# EAGLE design  ADS-B LNA Bias-T (EAGLE 9.5.1)
CNAME: ADS-B LNA Filter; CREVISION: 1.0; DESIGNER: Ujjwal John, VU3ECN
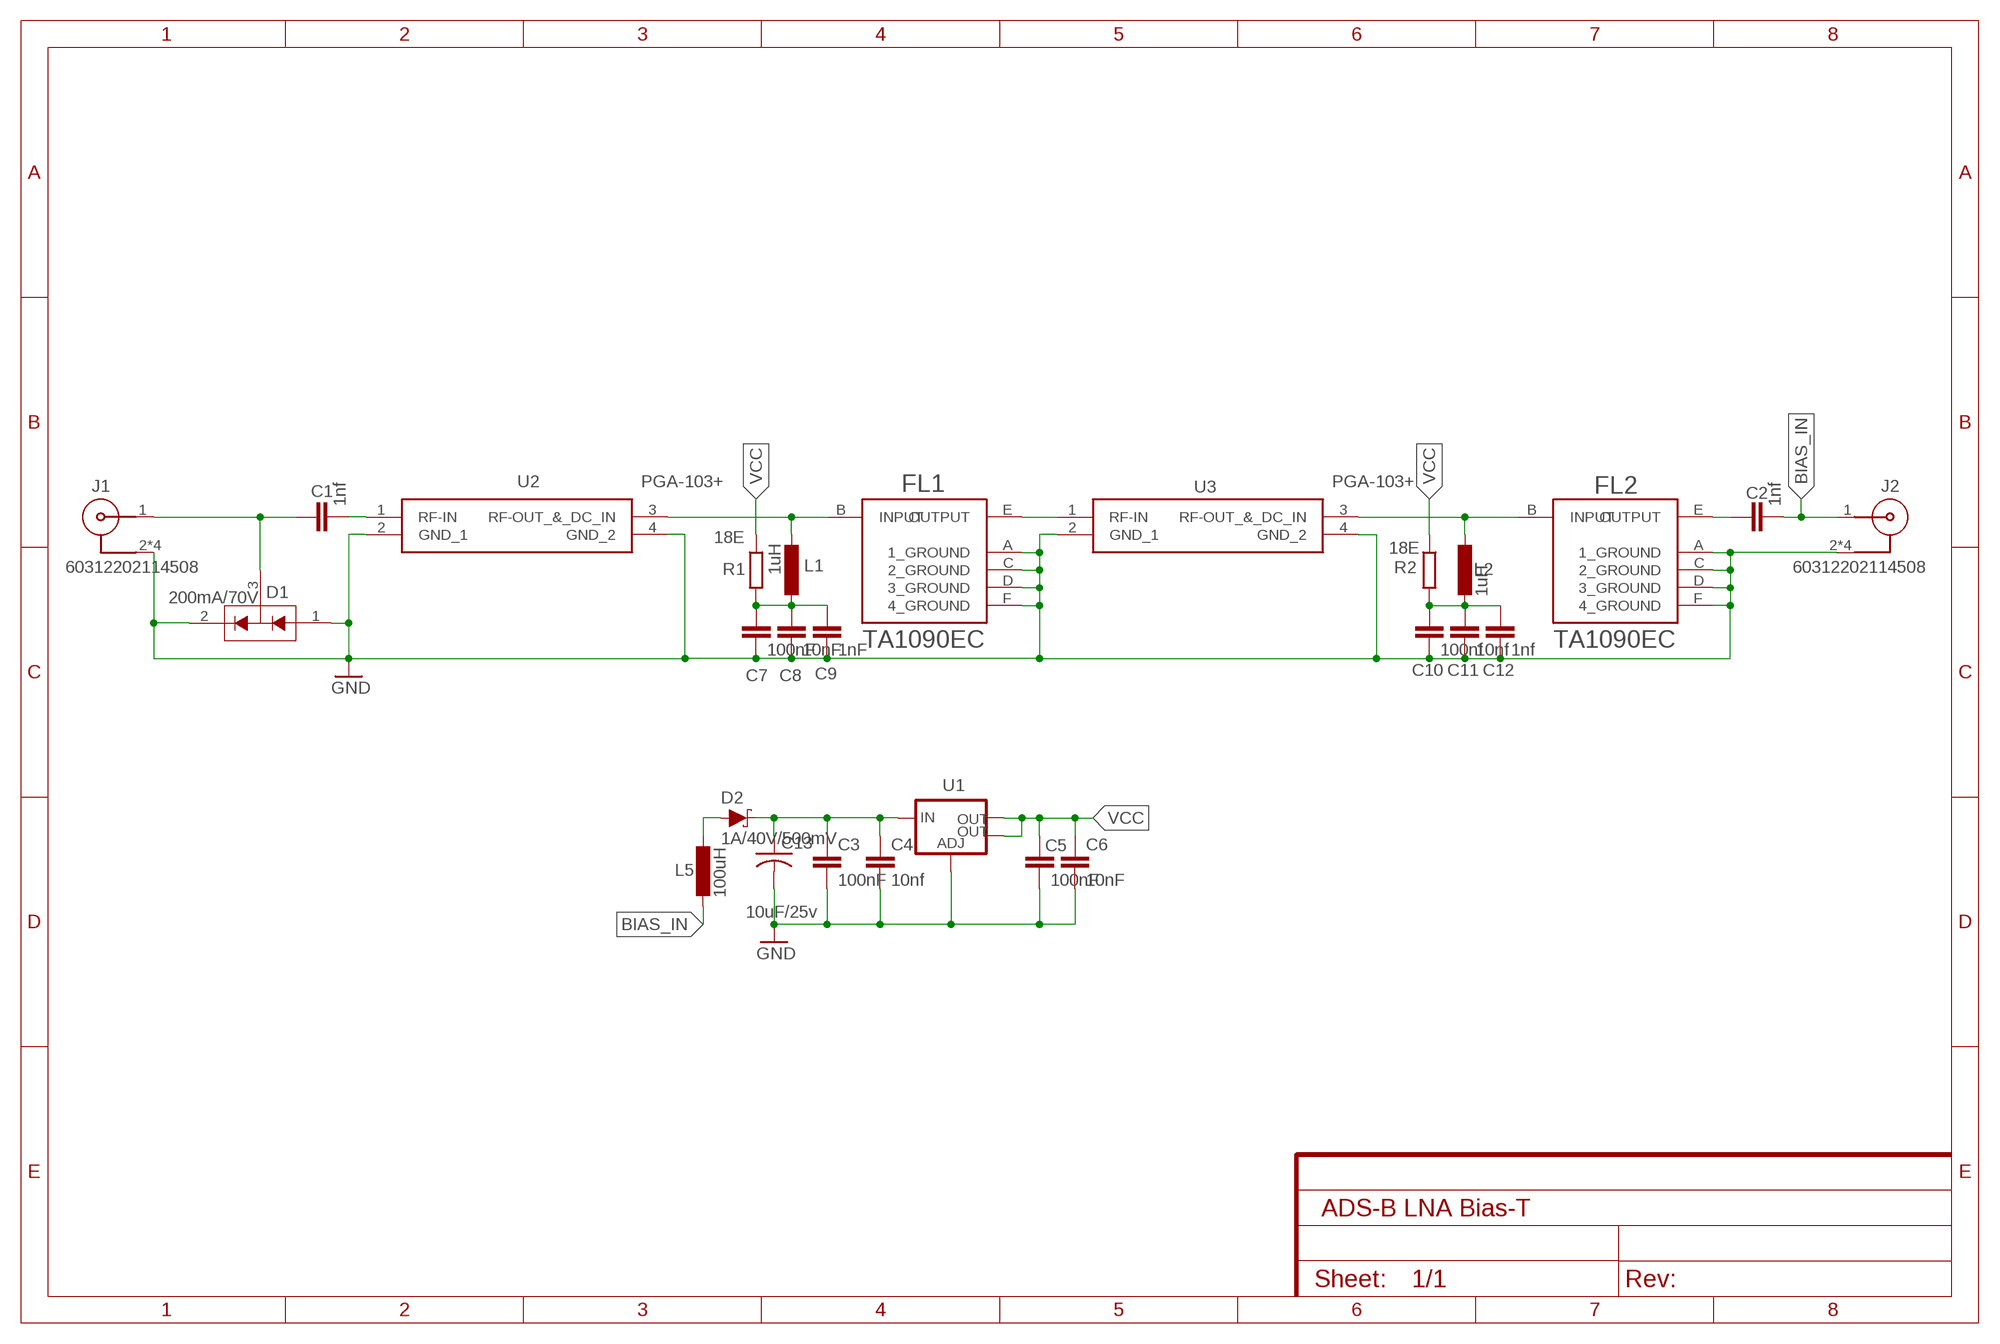
[diagram p0: schematic, sheet 1]

## Parts
C1  1nf  C-EUC0603K  [C0603K]
C2  1nf  C-EUC0603K  [C0603K]
C3  100nF  C-EUC0603K  [C0603K]
C4  10nf  C-EUC0603K  [C0603K]
C5  100nF  C-EUC0603K  [C0603K]
C6  10nF  C-EUC0603K  [C0603K]
C7  100nF  C-EUC0603K  [C0603K]
C8  10nF  C-EUC0603K  [C0603K]
C9  1nF  C-EUC0603K  [C0603K]
C10  100nf  C-EUC0603K  [C0603K]
C11  10nf  C-EUC0603K  [C0603K]
C12  1nf  C-EUC0603K  [C0603K]
C13  10uF/25v  C-USC3216  [C3216]
D1  200mA/70V  BAV99  [SOT23-3]
D2  1A/40V/500mV  DIODE-SCHOTTKY-SS14  [SMA-DIODE]
FL1  TAI-SAW_TECHNOLOGY_TA1090ECTAI-SAW_TECHNOLOGY_TA1090EC_0_0  [TAI-SAW_TECHNOLOGY_TA1090EC_0]
FL2  TAI-SAW_TECHNOLOGY_TA1090ECTAI-SAW_TECHNOLOGY_TA1090EC_0_0  [TAI-SAW_TECHNOLOGY_TA1090EC_0]
J1  60312202114508  [60312202114508]
J2  60312202114508  [60312202114508]
L1  1uH  L-EUL3230M  [L3230M]
L2  1uH  L-EUL3225M  [L3225M]
L5  100uH  L-EUL4532C  [L4532M]
R1  18E  R-EU_R1206  [R1206]
R2  18E  R-EU_R1206  [R1206]
U1  V_REG_LM1117SOT223  [SOT223]
U2  PGA-103+  [GVA63]
U3  PGA-103+  [GVA63]

## Nets
BIAS_IN: C2.2 J2.1 L5.2
GND: C3.2 C4.2 C5.2 C6.2 C7.2 C8.2 C9.2 C10.2 C11.2 C12.2 C13.2 D1.1(A1) D1.2(C2) FL1.A(1_GROUND) FL1.C(2_GROUND) FL1.D(3_GROUND) FL1.F(4_GROUND) FL2.A(1_GROUND) FL2.C(2_GROUND) FL2.D(3_GROUND) FL2.F(4_GROUND) J1.2 J1.3 J1.4 J1.5 J2.2 J2.3 J2.4 J2.5 U1.1(ADJ) U2.2(GND_1) U2.4(GND_2) U3.2(GND_1) U3.4(GND_2)
N$1: C1.2 U2.1(RF-IN)
N$2: C1.1 D1.3(COM) J1.1
N$3: FL1.E(OUTPUT) U3.1(RF-IN)
N$4: C7.1 C8.1 C9.1 L1.1 R1.2
N$5: C2.1 FL2.E(OUTPUT)
N$6: FL1.B(INPUT) L1.2 U2.3(RF-OUT_&_DC_IN)
N$7: C3.1 C4.1 C13.1 D2.C U1.3(IN)
N$8: C10.1 C11.1 C12.1 L2.2 R2.2
N$9: D2.A L5.1
N$10: FL2.B(INPUT) L2.1 U3.3(RF-OUT_&_DC_IN)
VCC: C5.1 C6.1 R1.1 R2.1 U1.2(OUT) U1.4(OUT)

## Library data of the parts
C1-C12 = rcl:C-EU: CAPACITOR, European symbol; SPICEPREFIX: C
C13 = rcl:C-US: CAPACITOR, American symbol; SPICEPREFIX: C
D1 = SparkFun-DiscreteSemi:BAV99: Series-pair diode array Two small signal silicon diodes connected anode to cathode. Connections to all three nodes available. Link to datasheet <https://www.fairchildsemi.com/datasheets/BA/BAV99.pdf> SparkFun Products: SparkFun AutoDriver <https://www.sparkfun.com/products/13752>; PROD_ID: DIO-10647
D2 = SparkFun-DiscreteSemi:DIODE-SCHOTTKY: Schottky diode A Schottky diode is a semiconductor diode which has a low forward voltage drop and a very fast switching action.; PROD_ID: DIO-08053
FL1 FL2 = Tai-Saw Technology - TA1090EC:TAI-SAW_TECHNOLOGY_TA1090EC: SAW Filter 1090MHz; BANDWIDTH: 30Mhz; CENTROID_NOT_SPECIFIED: No; DATASHEET: http://datasheet.octopart.com/TA1090EC-Tai-Saw-Technology-datasheet-15990272.pdf; FREQUENCY: 1090Mhz; IMPORTED_FROM: octopart; MF: Tai-Saw Technology; MPN: TA1090EC; NUM_PINS: 6; OCTOPART_PART_NUMBER: 42898a0e4c549d4e; PACKAGE: SMD_TA1090EC; PREFIX: FL; TEMPERATURE_RANGE_HIGH: +85°C; TEMPERATURE_RANGE_LOW: -30°C; TYPE: Filter, SAW, 1090 MHz, 30 MHz BW
J1 J2 = SMA Female PCB Edge S:60312202114508: WR-SMA PCB End Launch Jack Round Post 1.1 mm MATERIAL PROPERTIES Insulator Material PTFE Insulator Color White Center Contact Material Beryllium Copper Center Contact Plating Gold, min. 0.76µm over Nickel Body Material Brass Body Plating Gold, min. 0.076µm over Nickel KIND PROPERTIES Interface MIL-STD-348 Connector Type SMA Gender Jack Orientation Type Straight GENERAL INFORMATION: Operating Temperature -65 °C up to +165 °C Compliance RoHS ELECTRICAL PROPERTIES Frequency Range DC~18 GHz MECHANICAL PROPERTIES Mating Cycle 500 Cycles PACKAGING PROPERTIES Packaging Tray <https://katalog.we-online.com/media/images/v2/o122847v209%20WR-SMA_60312202114508.jpg> Details see: https://katalog.we-online.com/en/em/WR-SMA_60312202114508 Updated by Ella Wu, 2019-11-07 2019(C) Würth Elektronik Buy Part <https://snapeda.com/parts/60312202114508/W%C3%BCrth%20Elektronik/view-part/?ref=eda>; AVAILABILITY: Warning; DESCRIPTION: SMA Connector Jack, Female Socket 50Ohm Board Edge, End Launch Solder; DIGIKEY-PURCHASE-URL: https://snapeda.com/shop?store=DigiKey&id=4477264; MF: Würth Elektronik; MOUSER-PURCHASE-URL: https://snapeda.com/shop?store=Mouser&id=4477264; MP: 60312202114508; PACKAGE: None; PRICE: None
L1 = resistor:L-EU: INDUCTOR, European symbol
L2 L5 = rcl:L-EU: INDUCTOR, European symbol; SPICEPREFIX: L
R1 R2 = resistor:R-EU_: RESISTOR, European symbol
U1 = SparkFun-IC-Power:V_REG_LM1117: Voltage Regulator LM1117 Standard adjustable voltage regulator but in SMD form. Spark Fun Electronics SKU : COM-00595; PROD_ID: VREG-08170
U2 U3 = PGA-103+:PGA-103+: RF Amplifier SMT Low Noise Amplifier, 50Ohm - 4000 MHz, 50 Source: Datasheet <https://www.minicircuits.com/pdfs/PGA-103 .pdf>; DESCRIPTION: RF Amplifier SMT Low Noise Amplifier, 50Ohm - 4000 MHz, 50; HEIGHT: 1mm; MANUFACTURER_NAME: Mini-Circuits; MANUFACTURER_PART_NUMBER: PGA-103+; MOUSER_PART_NUMBER: 139-PGA-103; MOUSER_PRICE-STOCK: https://www.mouser.co.uk/ProductDetail/Mini-Circuits/PGA-103%2b?qs=xZ%2FP%252Ba9zWqZWniifnGTm5A%3D%3D

## Board
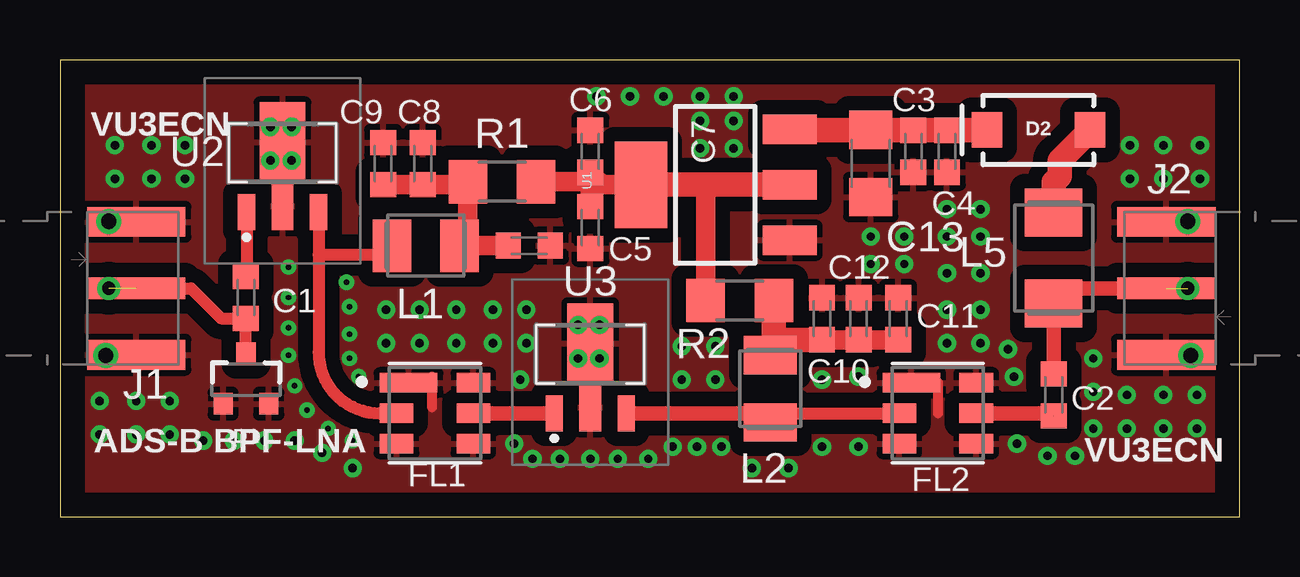
[diagram p1: board, top side]
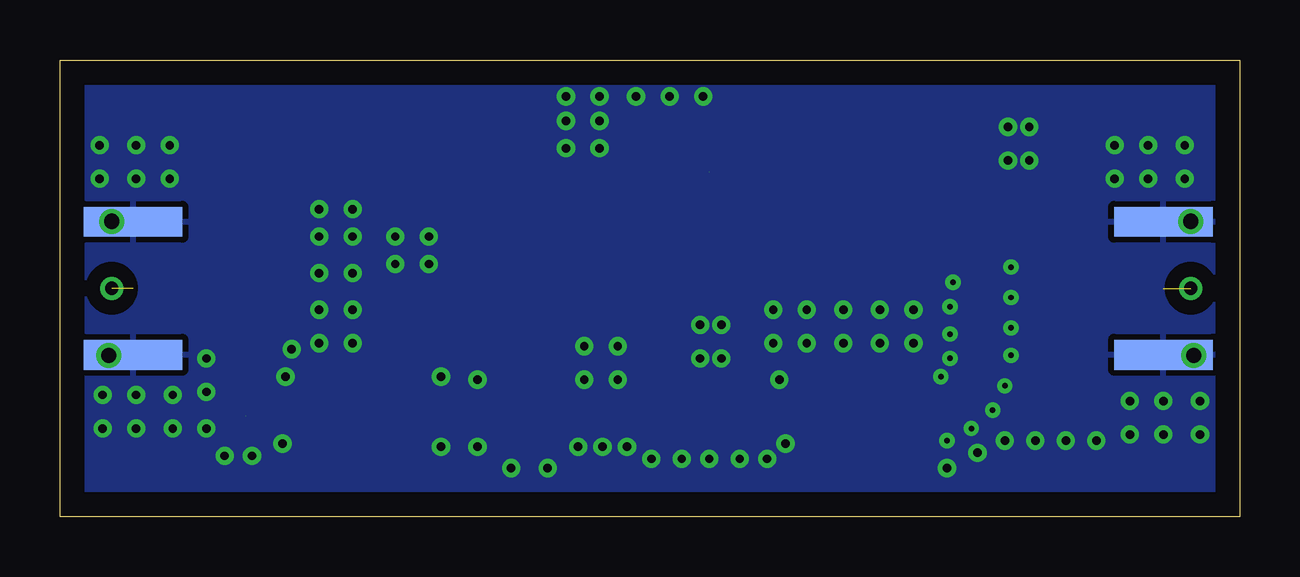
[diagram p2: board, bottom side, seen from below]

Size 49.15 x 19.05 mm. Coordinates in mm from the lower left corner, seen from the top.
Outline: 0,0 49.15,0 49.15,19.05 0,19.05 0,0
Copper layers (1*16): Top 0.035mm / dielectric 1.5mm / Bottom 0.035mm
Design rules "default *": minimum track width 6mil, minimum drill 0.35mm, track to track 24mil, track to pad 24mil, pad to pad 24mil, via to via 24mil, smd to smd 24mil, copper to edge 40mil, drill to drill 6mil, minimum pad ring 10mil, minimum via ring 8mil, stop-mask expansion 4mil, vias tented up to drill 0mil, thermal gap 10mil

### Footprints (pad centres in the part's own frame; a part is rotated, then mirrored left to right if it is on the bottom)
C0603K = smd 1.05 x 1.08: 1 -0.875,0; 2 0.875,0
C3216 = smd 1.6 x 1.8: 1 -1.4,0; 2 1.4,0
SOT23-3 = smd 0.8 x 0.9: 1 -0.95,-1; 2 0.95,-1; 3 0,1.1
SMA-DIODE = smd 1.27 x 1.47: A -2.15,0; C 2.15,0
TAI-SAW_TECHNOLOGY_TA1090EC_0 = smd 2.4 x 0.8: A -1.1,1.27 | smd 1.4 x 0.8: B -1.6,0; C -1.6,-1.27; D 1.6,-1.27; E 1.6,0; F 1.6,1.27
60312202114508 = smd 0.9 x 4.1: 1 0,0 | smd 1.25 x 4.1: 2 -2.775,0; 3 2.775,0 | smd 1.25 x 4.1 bottom: 4 -2.775,0; 5 2.775,0
L3230M = smd 1.6 x 2.2: 1 -1.4,0; 2 1.4,0
L3225M = smd 1.6 x 2.2: 1 -1.4,0; 2 1.4,0
L4532M = smd 2 x 2.4: 1 -1.9,0; 2 1.9,0
R1206 = smd 1.6 x 1.803: 1 -1.422,0; 2 1.422,0
SOT223 = smd 1.219 x 2.235: 1 -2.311,-3.099; 2 0,-3.099; 3 2.311,-3.099 | smd 3.6 x 2.2: 4 0,3.099
GVA63 = smd 0.711 x 1.5: 1 -1.5,-1.27; 3 1.5,-1.27 | smd 0.914 x 2: 2 0,-1.02 | smd 1.905 x 3.334: 4 0,1.647

### Placement (x,y rotation side)
C1  7.75,9.14 90 top
C2  41.4,5.08 90 top
C3  35.56,15.24 270 top
C4  36.96,15.24 270 top
C5  22.1,12.06 270 top
C6  22.1,15.24 90 top
C7  19.56,11.3 0 top
C8  15.11,14.73 90 top
C9  13.46,14.73 90 top
C10  31.75,8.26 90 top
C11  34.92,8.26 90 top
C12  33.27,8.26 90 top
C13  33.78,14.73 270 top
D1  7.75,5.71 0 top
D2  40.77,16.13 180 top
FL1  15.62,4.32 0 top
FL2  36.58,4.32 0 top
J1  3.18,9.53 270 top
J2  46.1,9.53 90 top
L1  15.24,11.3 180 top
L2  29.59,5.33 90 top
L5  41.4,10.79 270 top
R1  18.41,13.97 180 top
R2  28.32,9.02 0 top
U1  27.31,13.84 90 top
U2  9.27,13.97 0 top
U3  22.1,5.59 0 top

### Tracks (layer width: path | path; a pad name or v marks a point on that pad's centre or on a via)
BIAS_IN  (via drill 0.55)  (1 unrouted)
  Top 0.61: C2.2 L5.2 42.03,9.53 J2.1
  other vias: 46.99,9.53
GND  (via drill 0.23, 0.35, 0.64)
  Top 0.305: U3.4 U3.2
  Top 0.406: 15.49,5.84 15.49,4.57 | 36.58,5.59 36.58,4.32
  other vias: 13.59,8.64 14.99,8.64 14.99,7.24 13.59,7.24 19.18,5.71 31.75,5.71 18.92,3.05 25.53,2.92 26.54,2.92 27.56,2.92 28.83,2.03 33.27,5.84 39.88,3.05 39.75,5.84 2.29,15.49 3.81,15.49 5.21,15.49 5.21,14.1 3.81,14.1 2.29,14.1 47.5,14.1 45.97,14.1 44.58,14.1 44.58,15.49 45.97,15.49 47.5,15.49 44.45,5.08 45.97,5.08 47.37,5.08 47.37,3.68 45.97,3.68 44.45,3.68 22.35,17.53 23.75,17.53 28.07,16.51 26.67,16.51 28.07,17.53 26.67,17.53 25.15,17.53 27.31,5.71 25.91,5.71 25.91,7.11 27.31,7.11 16.51,8.64 18.03,8.64 19.43,8.64 19.43,7.24 18.03,7.24 16.51,7.24 41.15,2.54 42.29,2.54 30.35,2.03 31.75,2.92 33.27,2.92 43.05,3.68 43.05,5.21 43.05,6.6 19.69,2.41 20.83,2.41 24.51,2.41 23.24,2.41 22.1,2.41 36.96,7.24 36.96,8.64 38.35,8.64 38.35,7.24 36.96,10.16 36.96,11.68 36.96,12.83 38.35,12.83 38.35,11.68 38.35,10.16 28.07,15.37 26.67,15.37 35.18,11.68 33.78,11.68 35.18,10.54 33.78,10.54 1.65,4.83 3.18,4.83 4.57,4.83 4.57,3.43 3.18,3.43 1.65,3.43 2.03,12.32 1.91,6.73 46.99,12.32 47.12,6.73 8.76,16.26 8.76,14.86 9.65,16.26 9.65,14.86 21.59,8 21.59,6.6 22.48,8 22.48,6.6 39.5,6.99 5.97,3.18 9.53,10.41 9.53,9.14 9.53,7.87 9.53,6.73 9.78,5.46 10.29,4.45 11.18,3.68 12.19,3.18 11.94,9.78 12.07,8.76 12.07,7.62 12.07,6.6 12.45,5.84 7.24,3.18 9.78,3.18 10.92,2.67 8.51,3.18 12.19,2.03
  pour Top: -3.56,21.08 -3.56,-1.78 52.32,-1.78 52.32,21.08
  pour Bottom: -5.71,24.26 -5.71,-2.41 52.7,-2.41 52.7,24.26
N$1
  Top 0.508: U2.1 7.77,10.04 arc-90 C1.2
N$2  (via drill 0.55)  (1 unrouted)
  Top 0.508: D1.3 C1.1 6.72,8.27 5.46,9.53 J1.1
  other vias: 2.03,9.53
N$3
  Top 0.61: U3.1 FL1.E
N$4
  Top 0.813: C9.1 C8.1 16.88,13.86 R1.2 16.99,11.66 L1.1 C7.1
  Top 1.016: L1.1 16.51,11.43
N$5  (1 unrouted)
  Top 0.61: FL2.E 41.41,4.32 C2.1
N$6
  Top 0.508: U2.3 10.77,10.92 | 10.77,10.92 10.77,6.86 arc90 13.31,4.32 FL1.B | L1.2 arc-90 13.46,10.92 10.77,10.92
N$7
  Top 1.016: 35.57,16.13 C3.1 | D2.C 38.6,16.12 C4.1 C3.1 | C3.1 33.8,16.12 C13.1 30.43,16.13 U1.3
N$8
  Top 0.813: C10.1 C12.1 C11.1
  Top 1.016: C10.1 30.24,7.38 L2.2 29.74,6.89 R2.2
N$9
  Top 1.016: 41.53,12.82 L5.1 41.4,13.97 41.65,14.21 41.65,14.86 D2.A
N$10
  Top 0.508: 29.21,4.32 L2.1 | L2.1 29.97,4.32 FL2.B
  Top 0.61: L2.1 | U3.3 29.21,4.32
VCC  (1 unrouted)
  Top 0.813: U1.4 22.35,13.84 | R1.1 22.48,13.97 22.35,13.84 | 26.14,13.82 26.16,13.84 | 22.1,13.59 C5.1 C6.1 22.1,13.59 | 22.1,13.59 22.35,13.84 | R2.1 26.9,13.82 26.92,13.84
  Top 1.016: U1.2 26.92,13.84 26.16,13.84 U1.4

### Text on the board
tNames: VU3ECN | ADS-B BPF-LNA | VU3ECN